# EAGLE design battery-bulb (EAGLE 7.6.0)
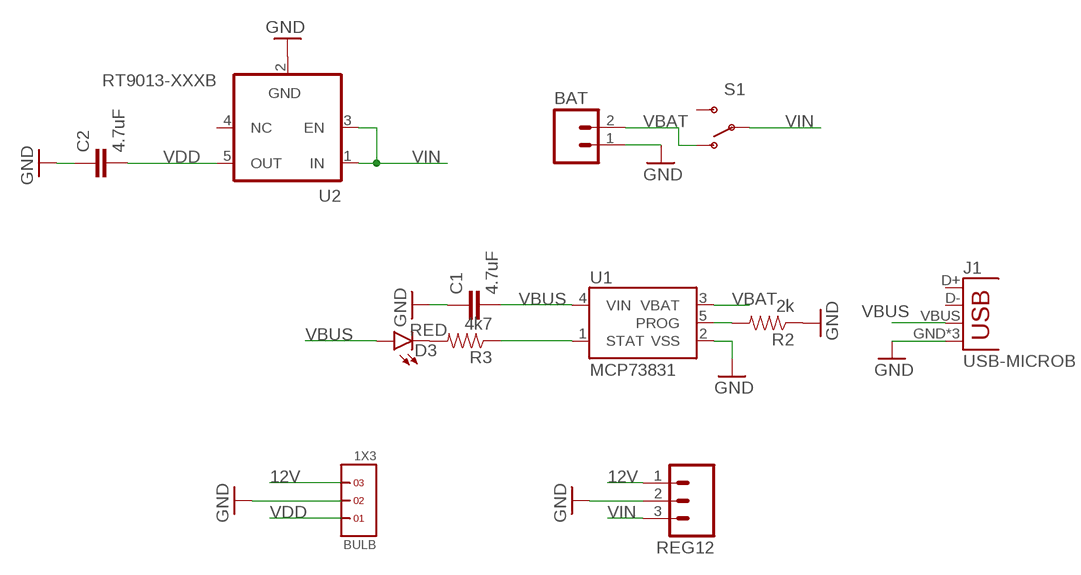
[diagram p0: schematic, sheet 1]

## Parts
BAT  M02JST-PTH-2  [JST-2-PTH]
BULB  1X3  [1X3]
C1  4.7uF  CAP0603-CAP  [0603-CAP]
C2  4.7uF  CAP0603-CAP  [0603-CAP]
D3  RED  LED-RED0603  [LED-0603]
J1  USB-MICROB  [USB-MICROB]
R2  2k  4.7OHM-1/10W-5%(0603)  [0603-RES]
R3  4k7  4.7OHM-1/10W-5%(0603)  [0603-RES]
REG12  M03LOCK  [1X03_LOCK]
S1  SWITCH-SPDT-SMD-A  [SWITCH-SPST-SMD-A]
U1  MCP73831  [SOT23-5]
U2  RT9013-XXXB  [SOT23-5]

## Nets
12V: BULB.3 REG12.1
GND: BAT.1 BULB.2 C1.1 C2.1 J1.GND J1.MT1(GND) J1.MT2(GND) R2.1 REG12.2 U1.2(VSS) U2.2(GND)
N$1: R2.2 U1.5(PROG)
N$4: R3.1 U1.1(STAT)
N$5: D3.C R3.2
VBAT: BAT.2 S1.1(O) U1.3(VBAT)
VBUS: C1.2 D3.A J1.VBUS U1.4(VIN)
VDD: BULB.1 C2.2 U2.5(OUT)
VIN: REG12.3 S1.2(P) U2.1(IN) U2.3(EN)
Unconnected: J1.D+ J1.D- S1.3(S) U2.4(NC)

## Library data of the parts
BAT = SparkFun-Connectors:M02: Standard 2-pin 0.1" header. Use with - straight break away headers ( PRT-00116) - right angle break away headers (PRT-00553) - swiss pins (PRT-00743) - machine pins (PRT-00117) - female headers (PRT-00115) Molex polarized connector foot print use with: PRT-08233 with associated crimp pins and housings. 2.54_SCREWTERM for use with PRT-10571. 3.5mm Screw Terminal footprints for PRT-08084 5mm Screw Terminal footprints for use with PRT-08432; PROD_ID: CONN-09863; SKU: PRT-09914
BULB = headers(2mm):1X3
C1 C2 = SparkFun-Passives:CAP: Capacitor Standard 0603 ceramic capacitor, and 0.1" leaded capacitor.
D3 = SparkFun-LED:LED-RED: Assorted Red LEDs LilyPad 1206- DIO-09912 1206- DIO-00809 0603- DIO-00819 "SMART" means more efficient and expensive; PROD_ID: DIO-00819
J1 = SparkFun-Connectors:USB: USB Connectors USB-B-PTH is fully proven SKU : PRT-00139/CONN-08278 USB-miniB is fully proven SKU : PRT-00587 USB-A-PCB is untested. USB-A-H is throughly reviewed, but untested. Spark Fun Electronics SKU : PRT-00437 USB-B-SMT is throughly reviewed, but untested. Needs silkscreen touching up. USB-A-S has not been used/tested USB-MB-H has not been used/tested USB-MICROB has been used. CONN-09505; PROD_ID: CONN-09505
R2 R3 = SparkFun-Resistors:4.7OHM-1/10W-5%(0603): RES-08295; PROD_ID: RES-08295
REG12 = SparkFun-Connectors:M03: Header 3 Standard 3-pin 0.1" header. Use with straight break away headers (SKU : PRT-00116), right angle break away headers (PRT-00553), swiss pins (PRT-00743), machine pins (PRT-00117), and female headers (PRT-00115). Molex polarized connector foot print use with SKU : PRT-08232 with associated crimp pins and housings.
S1 = SparkFun-Electromechanical:SWITCH-SPDT: SPDT Switch Simple slide switch, Spark Fun Electronics SKU : COM-00102 DPDT SMT slide switch, AYZ0202, SWCH-08179; PROD_ID: SWCH-10651
U1 = SparkFun-PowerIC:MCP73831: Miniature single cell, fully integrated Li-Ion, Li-polymer charge management controller http://ww1.microchip.com/downloads/en/DeviceDoc/20001984g.pdf IC-09995; PROD_ID: IC-09995
U2 = v-reg-new:RT9013-XXX: LDO REGULATOR 500mA, Low Dropout, Low Noise Ultra-Fast without bypass capacitor CMOS LDO Regulator

## Board
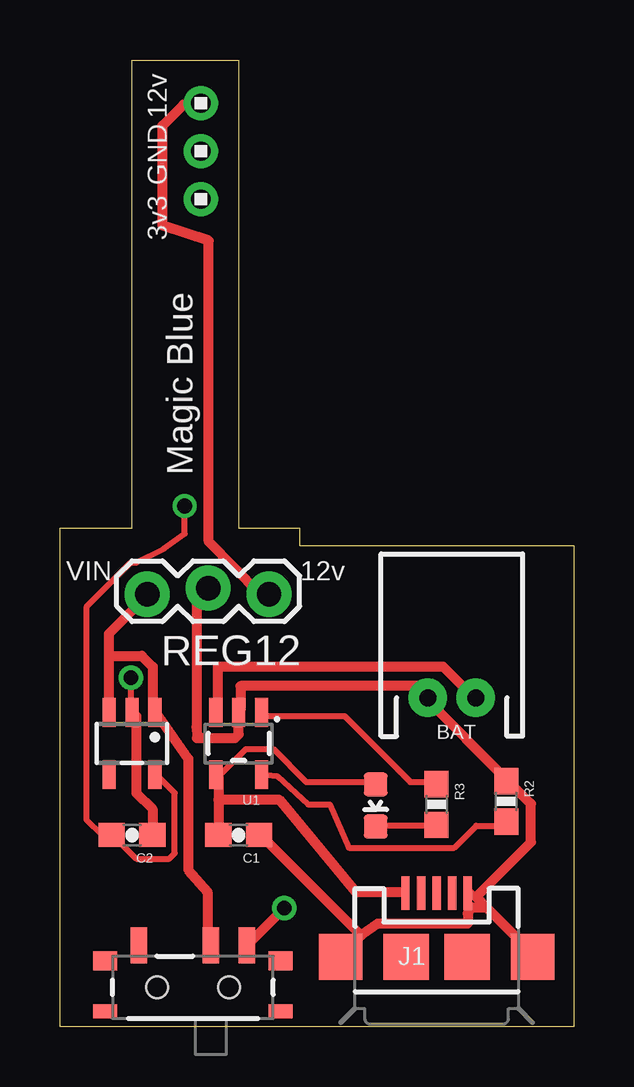
[diagram p1: board, top side]
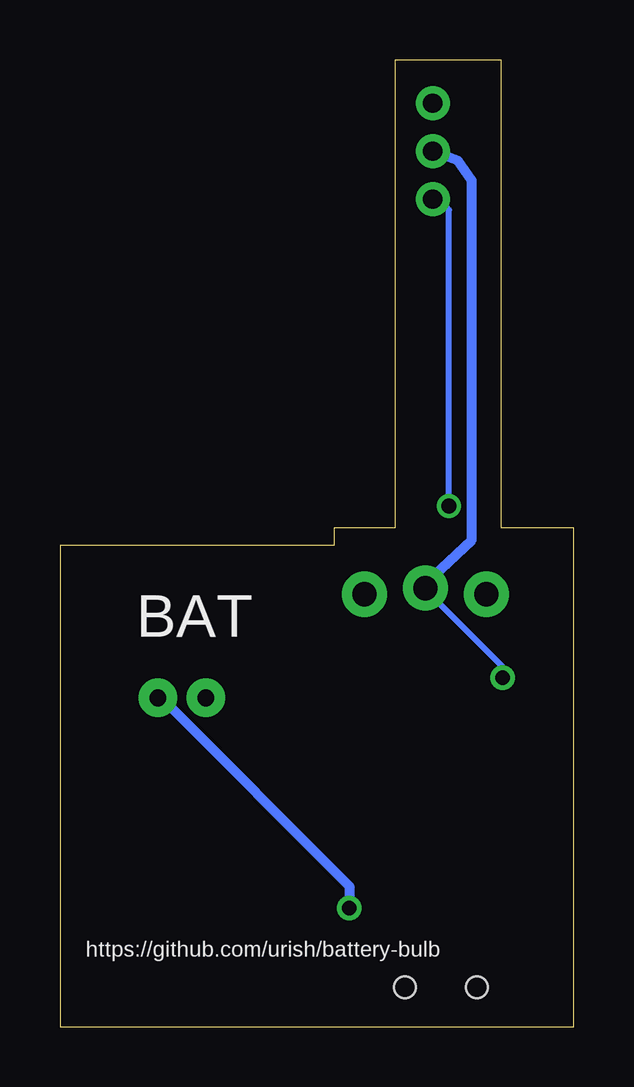
[diagram p2: board, bottom side, seen from below]

Size 21.42 x 40.3 mm. Coordinates in mm from the lower left corner, seen from the top.
Outline: 21.42,20.06 21.42,0 0,0 0,20.8 3.01,20.8 3.01,40.3 7.45,40.3 7.45,20.8 9.99,20.8 9.99,20.06 21.42,20.06
Copper layers (1*16): Top 0.035mm / dielectric 1.5mm / Bottom 0.035mm
Design rules "default *": minimum track width 10mil, minimum drill 24mil, track to track 8mil, track to pad 8mil, pad to pad 8mil, via to via 8mil, smd to smd 8mil, copper to edge 40mil, drill to drill 8mil, minimum pad ring 10mil, minimum via ring 8mil, stop-mask expansion 4mil, vias tented up to drill 0.61mm, thermal gap 10mil

### Footprints (pad centres in the part's own frame; a part is rotated, then mirrored left to right if it is on the bottom)
JST-2-PTH = drill 0.7 pad 1.6: 1 -1,0; 2 1,0
1X3 = drill 0.8 pad 1.422: 1 -2,0; 2 0,0; 3 2,0
0603-CAP = smd 1.1 x 1: 1 -0.85,0; 2 0.85,0
LED-0603 = smd 1 x 1: A 0,-0.877; C 0,0.877
USB-MICROB = smd 0.35 x 1.4: D+ 0,2.65; D- -0.65,2.65; GND 1.3,2.65; ID 0.65,2.65; VBUS -1.3,2.65 | smd 1.8 x 1.9: MT1 -4,0; MT2 4,0 | smd 1.9 x 1.9: P$1 -1.27,0; P$2 1.27,0
0603-RES = smd 1.1 x 1: 1 -0.85,0; 2 0.85,0
1X03_LOCK = drill 1.016 pad 1.88: 1 0,0.127; 2 2.54,-0.127; 3 5.08,0.127
SWITCH-SPST-SMD-A = smd 0.7 x 1.5: 1 -2.25,-1.75; 2 -0.75,-1.75; 3 2.25,-1.75 | smd 1 x 0.6: GND1 -3.65,1; GND3 3.65,1 | smd 1 x 0.8: GND2 -3.65,-1.1; GND4 3.65,-1.1 | hole 0.9: -1.5,0; 1.5,0
SOT23-5 = smd 0.55 x 1.2: 1 -0.95,-1.3; 2 0,-1.3; 3 0.95,-1.3; 4 0.95,1.3; 5 -0.95,1.3

### Placement (x,y rotation side)
BAT  16.34,13.71 0 top
BULB  5.88,36.5 90 top
C1  7.45,8 180 top
C2  3.01,8 180 top
D3  13.16,9.22 180 top
J1  15.7,2.91 0 top
R2  18.61,9.39 270 top
R3  15.7,9.27 270 top
REG12  8.72,18.15 180 top
S1  5.55,1.64 180 top
U1  7.45,11.81 180 top
U2  3.01,11.81 180 top

### Tracks (layer width: path | path; a pad name or v marks a point on that pad's centre or on a via)
12V
  Top 0.254: 8.35,18.05 8.6,18.05 REG12.1
  Top 0.406: 8.35,18.05 6.2,20.22 6.2,32.76 4.27,33.39 4.27,37.57 5.15,38.44 5.82,38.44 BULB.3
GND  (via drill 0.61)
  Top 0.254: 18.5,10.43 R2.1 18.73,10.21 | 15.3,13.63 BAT.1 | 17.36,5.4 17.13,5.63 J1.GND | 19.64,3.12 J1.MT2 | 3.18,12.95 U2.2 2.95,13.18 v2.95,14.55 | 5.7,17.75 6.16,18.21 REG12.2 6.35,18.43 | 8.44,7.92 C1.1 | 7.3,12.95 U1.2 | 12.55,3.8 11.87,3.12 J1.MT1 12.55,3.8
  Top 0.406: 15.3,13.63 18.5,10.43 | BAT.1 15.3,13.86 15.07,14.2 7.53,14.2 7.53,13.18 U1.2 7.45,12.19 7.3,12.03 5.71,12.03 5.7,12.49 5.7,17.75 | 17.77,4.99 17.36,5.4 19.64,7.69 19.64,9.29 18.73,10.21 | 17.77,4.99 19.64,3.12 | 3.18,12.95 3.18,9.75 3.86,9.07 C2.1 | 8.44,7.92 12.55,3.8 13.24,4.3 17,4.3 17,4.72 17.17,4.99 17.77,4.99
  Bottom 0.254: 6.16,18.43 REG12.2 | v2.95,14.55 2.95,15 6.16,18.21 REG12.2 | 5.6,18.05 5.6,17.8 REG12.2
  Bottom 0.406: BULB.2 4.82,36.1 4.25,35.28 4.25,20.3 6.18,18.47 REG12.2 5.87,18.28
N$1
  Top 0.254: R2.2 18.5,8.38 17.36,8.38 16.44,7.46 12.05,7.46 11.26,9.27 10.35,9.27 9.08,10.43 U1.5
N$4
  Top 0.254: R3.1 15.53,10.21 14.61,10.21 11.87,12.95 8.44,12.95 U1.1
N$5
  Top 0.254: D3.C 13.24,8.38 15.53,8.38 R3.2
VBAT  (via drill 0.61)
  Top 0.254: 17.13,13.86 BAT.2 | 7.98,3.57 S1.1
  Top 0.406: 17.13,13.86 15.98,15 6.58,15 6.58,13.63 6.5,13.55 U1.3 | v9.36,4.95 7.98,3.57
  Bottom 0.254: 17.13,13.63 BAT.2
  Bottom 0.406: v9.36,4.95 9.36,5.86 17.13,13.63
VBUS
  Top 0.254: 6.61,10.66 U1.4 6.61,10.43 7.76,11.58 8.9,11.58 10.27,10.21 13.01,10.21 D3.A | 6.61,8.15 C1.2 | 14.38,5.63 J1.VBUS
  Top 0.406: 6.61,10.43 6.61,9.47 | 6.61,9.47 6.61,8.15 | 14.38,5.63 12.33,5.63 9.13,9.47 6.61,9.47
VDD  (via drill 0.61)
  Top 0.254: U2.5 4.1,10.43 4.78,9.75 4.78,7.23 4.55,7 3.18,7 2.27,7.92 C2.2 1.73,8 1.1,8.63 1.1,17.5 2.95,19.35 3.18,19.35 4.33,19.92 5.2,20.55 v5.2,21.71
  Bottom 0.254: v5.2,21.71 5.2,34.05 5.35,34.3 BULB.1
VIN
  Top 0.254: 2.04,13.18 U2.3 | 3.64,17.98 REG12.3 | 3.87,13.18 U2.1 4.1,12.95 | 6.16,3.57 S1.2
  Top 0.406: 2.04,15.46 2.04,16.38 3.64,17.98 | 2.04,15.46 2.04,13.18 | 3.87,13.18 3.87,15 3.41,15.46 2.04,15.46 | 6.16,3.57 6.16,5.63 5.35,6.55 5.35,11.17 4.1,12.95

### Text on the board
tNames: 12v | GND | 3v3 | Magic Blue | VIN | 12v
bNames: BAT | https://github.com/urish/battery-bulb